# Altium schematic sheet main.SchDoc
size A4
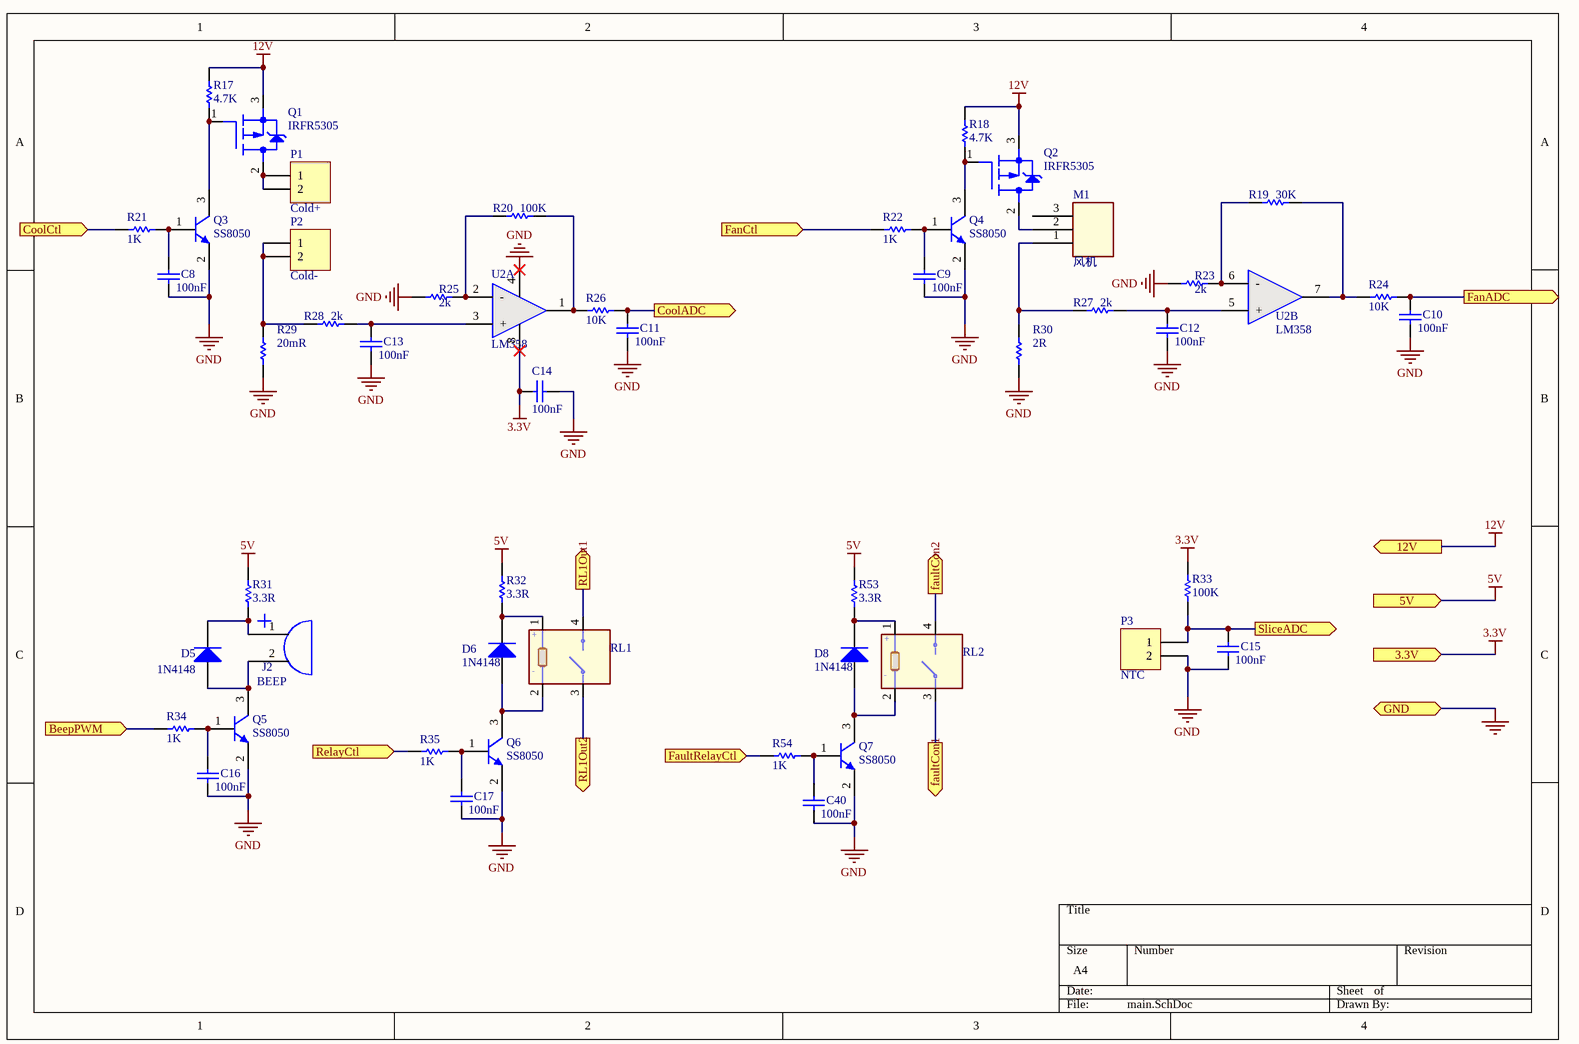
[diagram p0: main.SchDoc]

## Parts
C8  100nF (104) 10% 50V  [0603_C]  (value not drawn)
C9  100nF (104) 10% 50V  [0603_C]  (value not drawn)
C10  100nF (104) 10% 50V  [0603_C]  (value not drawn)
C11  100nF (104) 10% 50V  [0603_C]  (value not drawn)
C12  100nF (104) 10% 50V  [0603_C]  (value not drawn)
C13  100nF (104) 10% 50V  [0603_C]  (value not drawn)
C14  100nF (104) 10% 50V  [0603_C]  (value not drawn)
C15  100nF (104) 10% 50V  [0603_C]  (value not drawn)
C16  100nF (104) 10% 50V  [0603_C]  (value not drawn)
C17  100nF (104) 10% 50V  [0603_C]  (value not drawn)
C40  100nF (104) 10% 50V  [0603_C]  (value not drawn)
D5  1N4148  [DIODE-1206]
D6  1N4148  [DIODE-1206]
D8  1N4148  [DIODE-1206]
J2  BEEP  [Beep0905]
M1  风机  [connector3x2.5]
P1  Cold+  [ConSlice0.5]
P2  Cold-  [ConSlice0.5]
P3  NTC  [HDR1X2_2]
Q1  IRFR5305  [DPAK]
Q2  IRFR5305  [DPAK]
Q3  SS8050  [SOT-23]
Q4  SS8050  [SOT-23]
Q5  SS8050  [SOT-23]
Q6  SS8050  [SOT-23]
Q7  SS8050  [SOT-23]
R17  4.7K  [RESC1608N-R0603]
R18  4.7K  [RESC1608N-R0603]
R19  30K  [RESC1608N-R0603]
R20  100K  [RESC1608N-R0603]
R21  1K  [RESC1608N-R0603]
R22  1K  [RESC1608N-R0603]
R23  2k  [RESC1608N-R0603]
R24  10K  [RESC1608N-R0603]
R25  2k  [RESC1608N-R0603]
R26  10K  [RESC1608N-R0603]
R27  2k  [RESC1608N-R0603]
R28  2k  [RESC1608N-R0603]
R29  20mR  [Rsense10mm]
R30  2R  [R0.4x14.5]
R31  3.3R  [RESC1608N-R0603]
R32  3.3R  [RESC1608N-R0603]
R33  100K  [RESC1608N-R0603]
R34  1K  [RESC1608N-R0603]
R35  1K  [RESC1608N-R0603]
R53  3.3R  [RESC1608N-R0603]
R54  1K  [RESC1608N-R0603]
RL1  TXS2-24V  [ALDP112]  (value not drawn)
RL2  TXS2-24V  [ALDP112]  (value not drawn)
U2  LM358  [NSO8_N]  (parts A,B of 2)

## Ports
3.3V (in), 5V (in), 12V (out), BeepPWM (in), CoolADC (out), CoolCtl (in), FanADC (out), FanCtl (in), faultCon1 (out), faultCon2 (out), FaultRelayCtl (in), GND (bidir), RelayCtl (in), RL1Out1 (out), RL1Out2 (out), SliceADC (out)

## Nets
3.3V: C14.2 R33.1 U2.8(V+) ; port 3.3V
5V: R31.1 R32.1 R53.1 ; port 5V
12V: Q1.3(S) Q2.3(S) R17.1 R18.1 ; port 12V
GND: C8.1 C9.1 C10.1 C11.1 C12.1 C13.1 C14.1 C15.1 C16.1 C17.1 C40.1 P3.2 Q3.2(E) Q4.2(E) Q5.2(E) Q6.2(E) Q7.2(E) R23.2 R25.2 R29.1 R30.1 U2.4(V-) ; port GND
BeepPWM: R34.2 ; port BeepPWM
CoolADC: C11.2 R26.1 ; port CoolADC
CoolCtl: R21.2 ; port CoolCtl
FanADC: C10.2 R24.1 ; port FanADC
FanCtl: R22.2 ; port FanCtl
faultCon1: RL2.3 ; port faultCon1
faultCon2: RL2.4 ; port faultCon2
FaultRelayCtl: R54.2 ; port FaultRelayCtl
RelayCtl: R35.2 ; port RelayCtl
RL1Out1: RL1.4 ; port RL1Out1
RL1Out2: RL1.3 ; port RL1Out2
SliceADC: C15.2 P3.1 R33.2 ; port SliceADC
NetC8_2: C8.2 Q3.1(B) R21.1
NetC9_2: C9.2 Q4.1(B) R22.1
NetC12_2: C12.2 R27.1 U2.5(+)
NetC13_2: C13.2 R28.1 U2.3(+)
NetC16_2: C16.2 Q5.1(B) R34.1
NetC17_2: C17.2 Q6.1(B) R35.1
NetC40_2: C40.2 Q7.1(B) R54.1
NetD5_1: D5.1(A) J2.2 Q5.3(C)
NetD5_2: D5.2(K) J2.1 R31.2
NetD6_1: D6.1(A) Q6.3(C) RL1.2
NetD6_2: D6.2(K) R32.2 RL1.1
NetD8_1: D8.1(A) Q7.3(C) RL2.2
NetD8_2: D8.2(K) R53.2 RL2.1
NetM1_1: M1.1 R27.2 R30.2
NetM1_2: M1.2 Q2.2(D)
NetP1_1: P1.1 P1.2 Q1.2(D)
NetP2_1: P2.1 P2.2 R28.2 R29.2
NetQ1_1: Q1.1(G) Q3.3(C) R17.2
NetQ2_1: Q2.1(G) Q4.3(C) R18.2
NetR19_1: R19.1 R24.2 U2.7(OUT2)
NetR19_2: R19.2 R23.1 U2.6(-)
NetR20_1: R20.1 R26.2 U2.1(OUT1)
NetR20_2: R20.2 R25.1 U2.2(-)

Not connected (* = marked no-connect by the designer): M1 3

## Notes on the sheet
- (in symbol 0603 100nF (104) 10% 50V) 100nF
- (in symbol SACE_TXS2-24V_1) +

## Library data of the parts
C8-C17 C40 = 0603 100nF (104) 10% 50V: 贴片电容; ComponentLink1Description: 供应商链接; ComponentLink1URL: http://www.szlcsc.com/product/details_15331.html; Package: 0603; Supplier: LC; SuppliersPartNumber: C14663
D5 = Diode: 二极管; Published: 8-Jun-2000; LatestRevisionDate: 17-Jul-2002; LatestRevisionNote: Re-released for DXP Platform.; PackageDocument: Sep-1996; PackageReference: SMC; Publisher: Altium Limited; Code_JEDEC: DO-214-AB; Type: 1N4148
D6 D8 = Diode: 二极管; Type: M7; Published: 8-Jun-2000; LatestRevisionDate: 17-Jul-2002; LatestRevisionNote: Re-released for DXP Platform.; PackageDocument: Sep-1996; PackageReference: SMC; Publisher: Altium Limited; Code_JEDEC: DO-214-AB
J2 = BEEP: 蜂鸣器
M1 = SACE_CON_3: MALE CONN. 3 POLES P=7.62mm; Mfr_name1: WEIDMULLER; Mfr_Part_Number1: 1625260000; Part_type: MALE\THT; RU_code: RU6199001; Nr_pole: 3; Nr_row: 1; Prepared: BONOMI P.; Approved: LANZONI L.; Valore: 1625260000; Case_Size: -; Width: 8.5; Height: 12; Plating: -; Max_Operating_temp: -; Min_Operating_temp: -; Solderability_temp: -; Max_storage_temp: -; Min_storage_temp: -; Datasheet: K:\ORCAD CAPTURE CIS DATABASE\DATASHEET\CONNECTORS; Make_date: L6622; Last_rev_date: L6622; RoHs: True; Export_Control: N.A.
P1-P3 = Header 2: Header, 2-Pin; LatestRevisionDate: 17-Jul-2002; LatestRevisionNote: Re-released for DXP Platform.; Publisher: Altium Limited
Q1 Q2 = SACE_MOSFET_P: P-CH MOSFET LOGIC LEVEL 12A 60V SMD; Mfr_name1: ST; Mfr_Part_Number1: STD12NF06L; Part_Type: MOSFET\N-CHANNEL\SMD; RU_code: RU5189002; PackageID: D-PAK_AA_PITCH2.286MM_2PINS; Solderability_temp: 10s at 275°C; Max_operating_temp: +175°C; Min_operating_temp: -55°C; Prepared: BONOMI P.; Approved: MANZOLI R.; Notes: ST: / STD12NE06L-T4 is obsolete; Tolerance: -; Case_size: DPAK; Max_storage_temp: +175°C; Min_storage_temp: -55°C; Datasheet: K:\ORCAD CAPTURE CIS DATABASE\DATASHEET\DISCRETE; Make_date: L2587_DT; Last_rev_date: L3084_DT; RoHs: True; Export Control: N.A.; Valore: IRFR5305
Q3-Q7 = SS8050: NPN贴片三极管; Published: 8-Jun-2000; LatestRevisionDate: 15-Jan-2003; LatestRevisionNote: PCB Footprint 'BCY-W3/D4.7' replaced; DatasheetDocument: 1997; PackageDocument: Sep-1998; PackageReference: TO-92A; Publisher: Altium Limited; Code_JEDEC: TO-92A; ComponentLink1Description: Manufacturer Link; ComponentLink1URL: http://www.fairchildsemi.com/; ComponentLink2Description: Datasheet; ComponentLink2URL: http://www.fairchildsemi.com/ds/2N%2F2N3904.pdf
R17 R18 = RES1: 4.7K/±10%; 零件名称: 贴片电阻
R19 = RES1: 30K/±1%; 零件名称: 贴片电阻
R20 R33 = RES1: 100K/±10%; 零件名称: 贴片电阻
R21 R22 R34 R35 R54 = RES1: 1K/±10%; 零件名称: 贴片电阻
R23 R25 R27 R28 = RES1: 2k/±10%; 零件名称: 贴片电阻
R24 R26 = RES1: 10K/±10%; 零件名称: 贴片电阻
R29 R30 = Res1: Resistor; Value: 2mR; Published: 8-Jun-2000; LatestRevisionDate: 17-Jul-2002; LatestRevisionNote: Re-released for DXP Platform.; PackageReference: AXIAL-0.3; Publisher: Altium Limited; PackageDescription: Axial Device, Thru-Hole; 2 Leads; 0.3 in Pin Spacing
R31 R32 R53 = RES1: 3.3R/±10%; 零件名称: 贴片电阻
RL1 RL2 = SACE_TXS2-24V_1: MONOSTABLE RELAY 2POLES 110V 1A COIL24V; Mfr_name1: PANASONIC; Part_type: MONOSTABILE\THT; RU_code: RU6550001; Rated_voltage: 24; Max_operating_temp: +70°C; Min_operating_temp: -40°C; Life: 5x10^7 operations; Prepared: BONOMI P.; Approved: LANZONI L.; Valore: TXS2-24V; Mfr_Part_Number1: TXS2-24V; Case_Size: THT; Width: 7.4; Height: 8.2; Length: 15; Max_storage_temp: +70°C; Min_storage_temp: -40°C; Solderability_temp: -; Datasheet: K:\ORCAD CAPTURE CIS DATABASE\DATASHEET\RELAIS; Make_date: L9352; Last_rev_date: L9352; RoHs: True; Export_Control: N.A.
U2 = LM358: 双运放